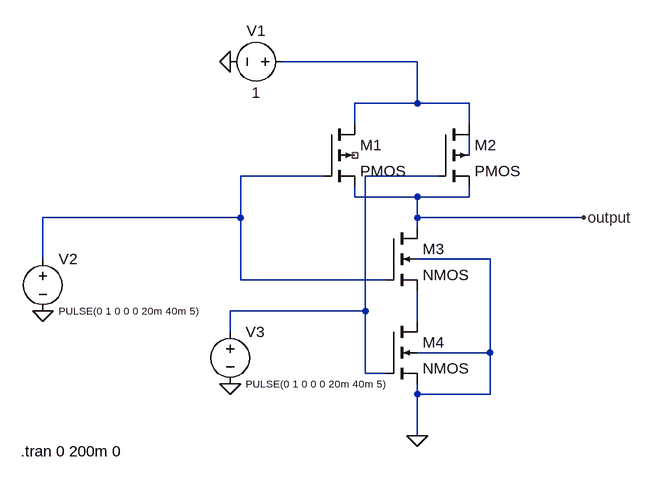
[diagram p0: schematic NAND gate 2 ip.asc]
NAND gate 2 ip.asc, the LTspice schematic file:
Version 4
SHEET 1 880 680
WIRE 208 -48 0 -48
WIRE 208 16 208 -48
WIRE 208 16 112 16
WIRE 288 16 208 16
WIRE 112 48 112 16
WIRE 288 48 288 16
WIRE 288 96 288 64
WIRE 64 128 -64 128
WIRE 240 128 128 128
WIRE 112 160 112 144
WIRE 208 160 112 160
WIRE 288 160 288 144
WIRE 288 160 208 160
WIRE -64 192 -64 128
WIRE -64 192 -368 192
WIRE 208 192 208 160
WIRE 464 192 208 192
WIRE 208 208 208 192
WIRE -368 256 -368 192
WIRE 320 256 208 256
WIRE -64 288 -64 192
WIRE 160 288 -64 288
WIRE 128 336 128 128
WIRE 128 336 -80 336
WIRE 208 352 208 304
WIRE -80 368 -80 336
WIRE 320 400 320 256
WIRE 320 400 208 400
WIRE 128 432 128 336
WIRE 160 432 128 432
WIRE 208 464 208 448
WIRE 320 464 320 400
WIRE 320 464 208 464
WIRE 208 528 208 464
FLAG 208 528 0
FLAG -368 336 0
FLAG -80 448 0
FLAG -80 -48 0
FLAG 464 192 output
SYMBOL pmos4 64 48 R0
SYMATTR InstName M1
SYMBOL pmos4 240 48 R0
SYMATTR InstName M2
SYMBOL nmos4 160 208 R0
SYMATTR InstName M3
SYMBOL nmos4 160 352 R0
SYMATTR InstName M4
SYMBOL voltage 16 -48 R90
WINDOW 0 -32 56 VBottom 2
WINDOW 3 32 56 VTop 2
WINDOW 123 0 0 Left 0
WINDOW 39 0 0 Left 0
SYMATTR InstName V1
SYMATTR Value 1
SYMBOL voltage -368 240 R0
WINDOW 3 24 96 Left 1
WINDOW 123 0 0 Left 0
WINDOW 39 0 0 Left 0
SYMATTR InstName V2
SYMATTR Value PULSE(0 1 0 0 0 20m 40m 5)
SYMBOL voltage -80 352 R0
WINDOW 3 24 96 Left 1
WINDOW 123 0 0 Left 0
WINDOW 39 0 0 Left 0
SYMATTR InstName V3
SYMATTR Value PULSE(0 1 0 0 0 20m 40m 5)
TEXT -402 552 Left 2 !.tran 0 200m 0

The netlist it stands for:
* NAND gate 2 ip.asc
M1 N001 N003 output NC_01 PMOS
M2 N001 N004 output N002 PMOS
M3 output N003 N005 0 NMOS
M4 N005 N004 0 0 NMOS
V1 N001 0 1
V2 N003 0 PULSE(0 1 0 0 0 20m 40m 5)
V3 N004 0 PULSE(0 1 0 0 0 20m 40m 5)
.model NMOS NMOS
.model PMOS PMOS
.lib standard.mos
.tran 0 200m 0
.backanno
.end